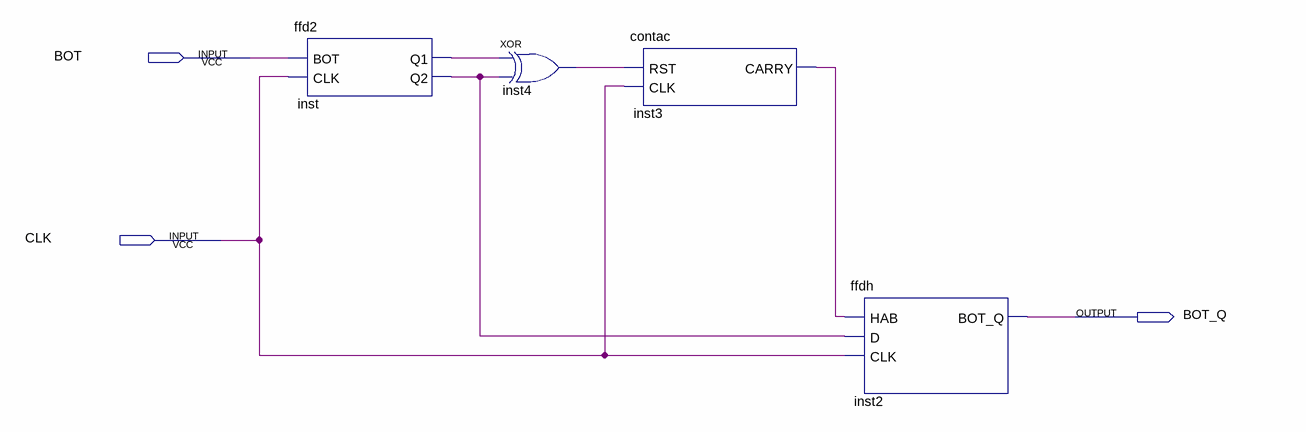
[diagram p0: schematic sheet]
// Quartus schematic brinco.bdf as structural Verilog: 4 symbols, 3 pins
module brinco (
  input  BOT,
  input  CLK,
  output BOT_Q
);

  wire inst3_carry, inst4_out, inst_q1, inst_q2;

  ffd2 inst (.BOT(BOT), .CLK(CLK), .Q1(inst_q1), .Q2(inst_q2));
  xor inst4 (inst4_out, inst_q1, inst_q2);
  contac inst3 (.RST(inst4_out), .CLK(CLK), .CARRY(inst3_carry));
  ffdh inst2 (.HAB(inst3_carry), .D(inst_q2), .CLK(CLK), .BOT_Q(BOT_Q));
endmodule
